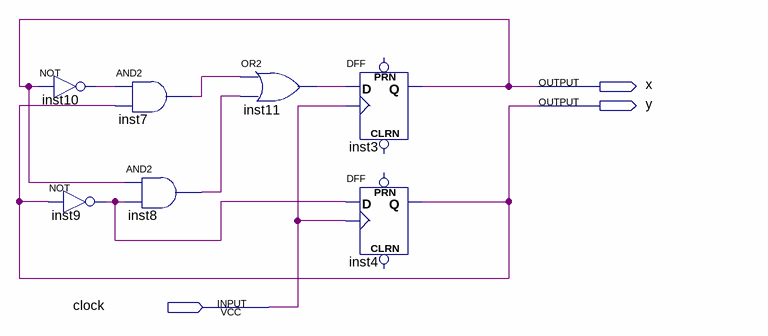
[diagram p0: schematic sheet]
// Quartus schematic count_03.bdf as structural Verilog: 7 symbols, 3 pins
module count_03 (
  input  clock,
  output x,
  output y
);

  wire inst7_out, inst8_out, inst9_out, inst10_out, inst11_out;

  not inst10 (inst10_out, x);
  and inst7 (inst7_out, inst10_out, y);
  not inst9 (inst9_out, y);
  and inst8 (inst8_out, x, inst9_out);
  or inst11 (inst11_out, inst7_out, inst8_out);
  DFF inst3 (.CLK(clock), .D(inst11_out), .Q(x));  // open: CLRN, PRN
  DFF inst4 (.CLK(clock), .D(inst9_out), .Q(y));  // open: CLRN, PRN
endmodule
